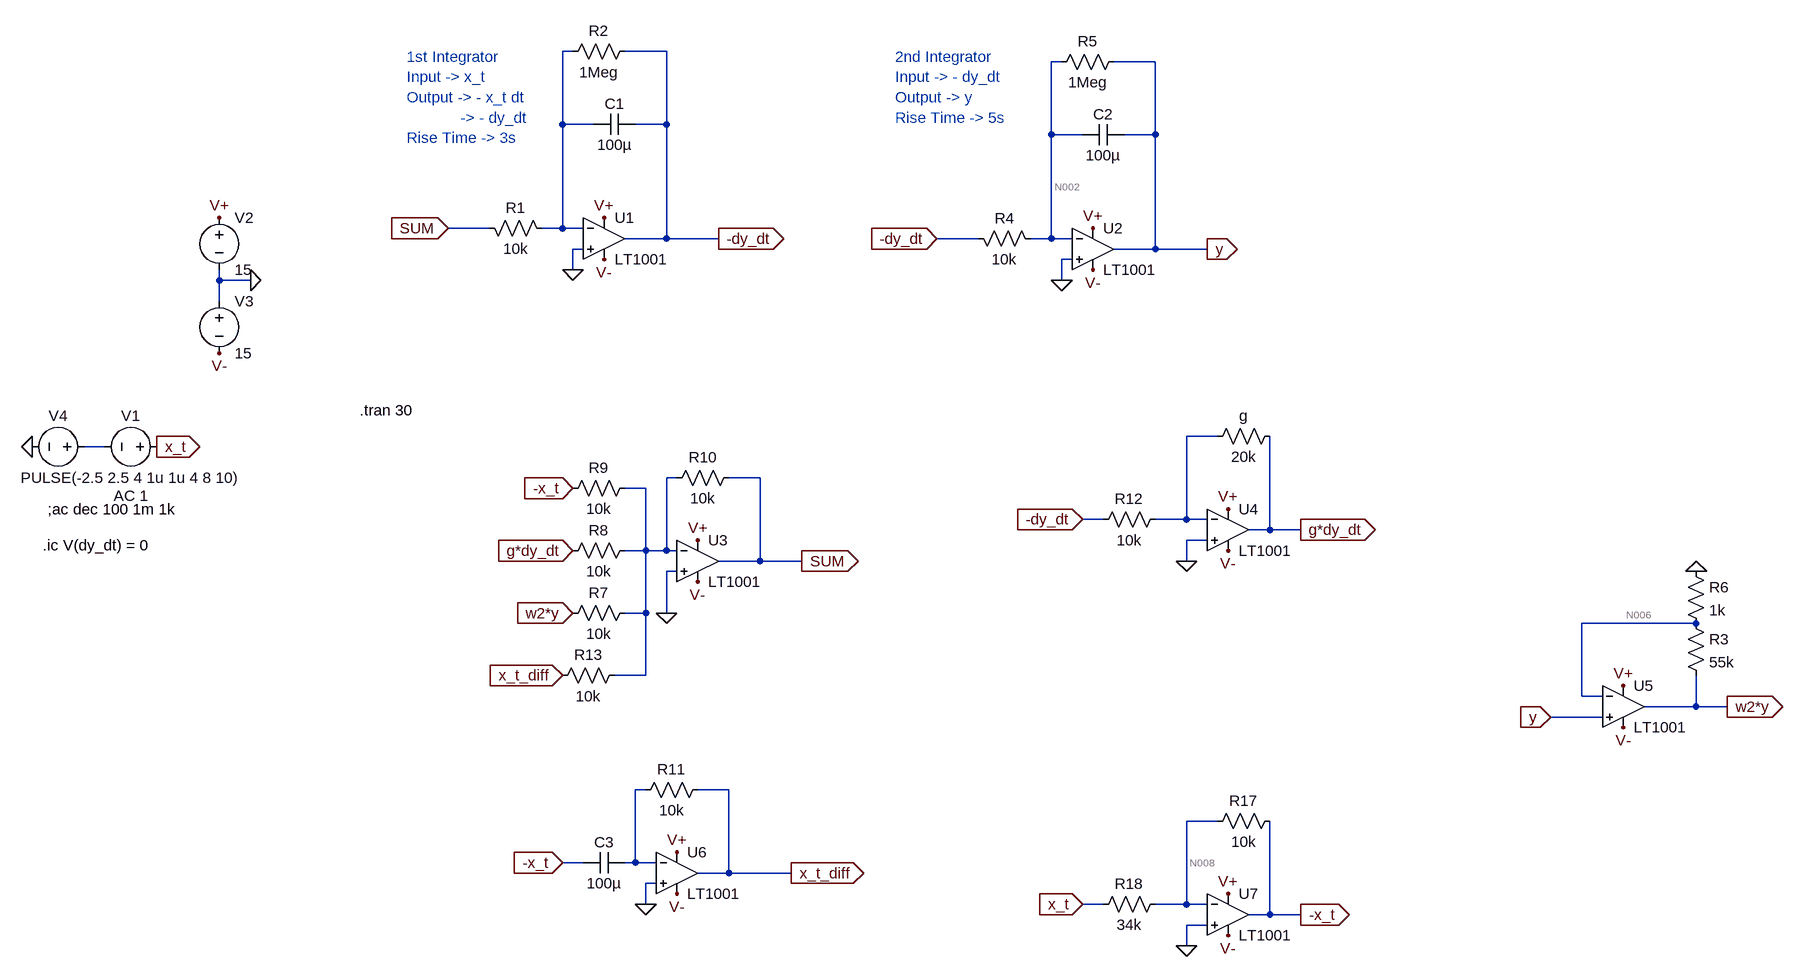
[diagram p0: schematic Analogue_Computer_5.asc]
Analogue_Computer_5.asc, the LTspice schematic file:
Version 4
SHEET 1 1932 1080
WIRE 32 -352 16 -352
WIRE 176 -352 112 -352
WIRE 784 -336 768 -336
WIRE 928 -336 864 -336
WIRE 16 -240 16 -352
WIRE 64 -240 16 -240
WIRE 176 -240 176 -352
WIRE 176 -240 128 -240
WIRE 768 -224 768 -336
WIRE 816 -224 768 -224
WIRE 928 -224 928 -336
WIRE 928 -224 880 -224
WIRE -96 -80 -160 -80
WIRE 16 -80 16 -240
WIRE 16 -80 -16 -80
WIRE 48 -80 16 -80
WIRE 176 -64 176 -240
WIRE 176 -64 112 -64
WIRE 256 -64 176 -64
WIRE 656 -64 592 -64
WIRE 768 -64 768 -224
WIRE 768 -64 736 -64
WIRE 800 -64 768 -64
WIRE 48 -48 32 -48
WIRE 928 -48 928 -224
WIRE 928 -48 864 -48
WIRE 1008 -48 928 -48
WIRE 800 -32 784 -32
WIRE 32 -16 32 -48
WIRE -512 0 -512 -16
WIRE -464 0 -512 0
WIRE 784 0 784 -32
WIRE -512 32 -512 0
WIRE 1024 240 976 240
WIRE -688 256 -720 256
WIRE 192 304 176 304
WIRE 320 304 272 304
WIRE 144 320 112 320
WIRE 848 368 816 368
WIRE 976 368 976 240
WIRE 976 368 928 368
WIRE 1008 368 976 368
WIRE 1104 384 1104 240
WIRE 1104 384 1072 384
WIRE 1152 384 1104 384
WIRE 1008 400 976 400
WIRE 144 416 144 320
WIRE 144 416 112 416
WIRE 176 416 176 304
WIRE 176 416 144 416
WIRE 192 416 176 416
WIRE 320 432 320 304
WIRE 320 432 256 432
WIRE 384 432 320 432
WIRE 976 432 976 400
WIRE 192 448 176 448
WIRE 144 512 144 416
WIRE 144 512 112 512
WIRE 176 512 176 448
WIRE 1760 528 1584 528
WIRE 144 608 144 512
WIRE 144 608 96 608
WIRE 1584 640 1584 528
WIRE 1616 640 1584 640
WIRE 1760 656 1760 608
WIRE 1760 656 1680 656
WIRE 1808 656 1760 656
WIRE 1616 672 1536 672
WIRE 144 784 128 784
WIRE 272 784 224 784
WIRE 1024 832 976 832
WIRE 48 896 16 896
WIRE 128 896 128 784
WIRE 128 896 112 896
WIRE 160 896 128 896
WIRE 272 912 272 784
WIRE 272 912 224 912
WIRE 368 912 272 912
WIRE 160 928 144 928
WIRE 144 960 144 928
WIRE 848 960 816 960
WIRE 976 960 976 832
WIRE 976 960 928 960
WIRE 1008 960 976 960
WIRE 1104 976 1104 832
WIRE 1104 976 1072 976
WIRE 1152 976 1104 976
WIRE 1008 992 976 992
WIRE 976 1024 976 992
FLAG -464 0 0
FLAG -512 -96 V+
FLAG -512 112 V-
FLAG 80 -96 V+
FLAG 80 -32 V-
FLAG 256 -64 -dy_dt
IOPIN 256 -64 Out
FLAG -608 256 x_t
IOPIN -608 256 Out
FLAG 832 -80 V+
FLAG 832 -16 V-
FLAG 1008 -48 y
IOPIN 1008 -48 Out
FLAG 592 -64 -dy_dt
IOPIN 592 -64 In
FLAG 224 400 V+
FLAG 224 464 V-
FLAG 384 432 SUM
IOPIN 384 432 Out
FLAG 176 512 0
FLAG -160 -80 SUM
IOPIN -160 -80 In
FLAG 976 432 0
FLAG 816 368 -dy_dt
IOPIN 816 368 In
FLAG 1152 384 g*dy_dt
IOPIN 1152 384 Out
FLAG 976 1024 0
FLAG 816 960 x_t
IOPIN 816 960 In
FLAG 1152 976 -x_t
IOPIN 1152 976 Out
FLAG 32 320 -x_t
IOPIN 32 320 In
FLAG 32 512 w2*y
IOPIN 32 512 In
FLAG 32 416 g*dy_dt
IOPIN 32 416 In
FLAG 1040 944 V+
FLAG 1040 352 V+
FLAG 1040 1008 V-
FLAG 1040 416 V-
FLAG -800 256 0
FLAG 32 -16 0
FLAG 784 0 0
FLAG 1648 624 V+
FLAG 1648 688 V-
FLAG 1536 672 y
IOPIN 1536 672 In
FLAG 1760 448 0
FLAG 1808 656 w2*y
IOPIN 1808 656 Out
FLAG 192 880 V+
FLAG 192 944 V-
FLAG 144 960 0
FLAG 16 896 -x_t
IOPIN 16 896 In
FLAG 368 912 x_t_diff
IOPIN 368 912 Out
FLAG 16 608 x_t_diff
IOPIN 16 608 In
SYMBOL OpAmps\\LT1001 80 -128 R0
SYMATTR InstName U1
SYMBOL res -112 -96 M90
WINDOW 0 0 56 VBottom 2
WINDOW 3 32 56 VTop 2
SYMATTR InstName R1
SYMATTR Value 10k
SYMBOL voltage -592 256 R90
WINDOW 0 -32 56 VBottom 2
WINDOW 3 32 56 VTop 2
WINDOW 123 60 56 VTop 2
WINDOW 39 0 0 Left 0
SYMATTR InstName V1
SYMATTR Value PULSE(-2.5 2.5 4 1u 1u 4 8 10)
SYMATTR Value2 AC 1
SYMBOL voltage -512 -112 R0
WINDOW 123 0 0 Left 0
WINDOW 39 0 0 Left 0
SYMATTR InstName V2
SYMATTR Value 15
SYMBOL voltage -512 16 R0
WINDOW 123 0 0 Left 0
WINDOW 39 0 0 Left 0
SYMATTR InstName V3
SYMATTR Value 15
SYMBOL cap 128 -256 R90
WINDOW 0 0 32 VBottom 2
WINDOW 3 32 32 VTop 2
SYMATTR InstName C1
SYMATTR Value 100µ
SYMBOL res 128 -368 R90
WINDOW 0 0 56 VBottom 2
WINDOW 3 32 56 VTop 2
SYMATTR InstName R2
SYMATTR Value 1Meg
SYMBOL OpAmps\\LT1001 832 -112 R0
SYMATTR InstName U2
SYMBOL res 640 -80 M90
WINDOW 0 0 56 VBottom 2
WINDOW 3 32 56 VTop 2
SYMATTR InstName R4
SYMATTR Value 10k
SYMBOL cap 880 -240 R90
WINDOW 0 0 32 VBottom 2
WINDOW 3 32 32 VTop 2
SYMATTR InstName C2
SYMATTR Value 100µ
SYMBOL res 880 -352 R90
WINDOW 0 0 56 VBottom 2
WINDOW 3 32 56 VTop 2
SYMATTR InstName R5
SYMATTR Value 1Meg
SYMBOL OpAmps\\LT1001 224 368 R0
SYMATTR InstName U3
SYMBOL res 128 496 R90
WINDOW 0 0 56 VBottom 2
WINDOW 3 32 56 VTop 2
SYMATTR InstName R7
SYMATTR Value 10k
SYMBOL res 128 400 R90
WINDOW 0 0 56 VBottom 2
WINDOW 3 32 56 VTop 2
SYMATTR InstName R8
SYMATTR Value 10k
SYMBOL res 128 304 R90
WINDOW 0 0 56 VBottom 2
WINDOW 3 32 56 VTop 2
SYMATTR InstName R9
SYMATTR Value 10k
SYMBOL res 288 288 R90
WINDOW 0 0 56 VBottom 2
WINDOW 3 32 56 VTop 2
SYMATTR InstName R10
SYMATTR Value 10k
SYMBOL OpAmps\\LT1001 1040 320 R0
SYMATTR InstName U4
SYMBOL res 1120 224 R90
WINDOW 0 0 56 VBottom 2
WINDOW 3 32 56 VTop 2
SYMATTR InstName g
SYMATTR Value 20k
SYMBOL res 944 352 R90
WINDOW 0 0 56 VBottom 2
WINDOW 3 32 56 VTop 2
SYMATTR InstName R12
SYMATTR Value 10k
SYMBOL OpAmps\\LT1001 1040 912 R0
SYMATTR InstName U7
SYMBOL res 1120 816 R90
WINDOW 0 0 56 VBottom 2
WINDOW 3 32 56 VTop 2
SYMATTR InstName R17
SYMATTR Value 10k
SYMBOL res 944 944 R90
WINDOW 0 0 56 VBottom 2
WINDOW 3 32 56 VTop 2
SYMATTR InstName R18
SYMATTR Value 34k
SYMBOL voltage -704 256 R90
WINDOW 0 -32 56 VBottom 2
WINDOW 3 32 56 VTop 2
WINDOW 123 0 0 Left 0
WINDOW 39 0 0 Left 0
SYMATTR InstName V4
SYMATTR Value ""
SYMBOL OpAmps\\LT1001 1648 592 R0
SYMATTR InstName U5
SYMBOL res 1744 512 R0
SYMATTR InstName R3
SYMATTR Value 55k
SYMBOL res 1744 432 R0
SYMATTR InstName R6
SYMATTR Value 1k
SYMBOL OpAmps\\LT1001 192 848 R0
SYMATTR InstName U6
SYMBOL cap 112 880 R90
WINDOW 0 0 32 VBottom 2
WINDOW 3 32 32 VTop 2
SYMATTR InstName C3
SYMATTR Value 100µ
SYMBOL res 240 768 R90
WINDOW 0 0 56 VBottom 2
WINDOW 3 32 56 VTop 2
SYMATTR InstName R11
SYMATTR Value 10k
SYMBOL res 112 592 R90
WINDOW 0 0 56 VBottom 2
WINDOW 3 32 56 VTop 2
SYMATTR InstName R13
SYMATTR Value 10k
TEXT -776 352 Left 2 !;ac dec 100 1m 1k
TEXT -784 408 Left 2 !.ic V(dy_dt) = 0
TEXT -224 -344 Left 2 ;1st Integrator\nInput -> x_t\nOutput -> - x_t dt\n            -> - dy_dt\nRise Time -> 3s
TEXT 528 -344 Left 2 ;2nd Integrator\nInput -> - dy_dt\nOutput -> y\nRise Time -> 5s
TEXT -296 200 Left 2 !.tran 30

The netlist it stands for:
* Analogue_Computer_5.asc
XU1 0 N001 V+ V- -dy_dt LT1001  ; pins In+ In- V+ V- OUT
R1 SUM N001 10k
V1 x_t N004 PULSE(-2.5 2.5 4 1u 1u 4 8 10) AC 1
V2 V+ 0 15
V3 0 V- 15
C1 -dy_dt N001 100µ
R2 -dy_dt N001 1Meg
XU2 0 N002 V+ V- y LT1001  ; pins In+ In- V+ V- OUT
R4 -dy_dt N002 10k
C2 y N002 100µ
R5 y N002 1Meg
XU3 0 N005 V+ V- SUM LT1001  ; pins In+ In- V+ V- OUT
R7 N005 w2*y 10k
R8 N005 g*dy_dt 10k
R9 N005 -x_t 10k
R10 SUM N005 10k
XU4 0 N003 V+ V- g*dy_dt LT1001  ; pins In+ In- V+ V- OUT
R§g g*dy_dt N003 20k
R12 N003 -dy_dt 10k
XU7 0 N008 V+ V- -x_t LT1001  ; pins In+ In- V+ V- OUT
R17 -x_t N008 10k
R18 N008 x_t 34k
V4 N004 0
XU5 y N006 V+ V- w2*y LT1001  ; pins In+ In- V+ V- OUT
R3 N006 w2*y 55k
R6 0 N006 1k
XU6 0 N007 V+ V- x_t_diff LT1001  ; pins In+ In- V+ V- OUT
C3 N007 -x_t 100µ
R11 x_t_diff N007 10k
R13 N005 x_t_diff 10k
;ac dec 100 1m 1k
.ic V(dy_dt) = 0
* 1st Integrator
* Input -> x_t
* Output -> - x_t dt
*             -> - dy_dt
* Rise Time -> 3s
* 2nd Integrator
* Input -> - dy_dt
* Output -> y
* Rise Time -> 5s
.tran 30
.lib LTC.lib
.backanno
.end

* Results of the author's LTspice run, read from the files saved beside the schematic
* Operating Point, zero values left out:
*   V(v+) = 15 V
*   V(v-) = -15 V
*   V(-dy_dt) = 131.3 µV
*   V(sum) = -1.313 µV
*   V(x_t) = -2.5 V
*   V(n002) = 17.59 nV
*   V(y) = -13.13 mV
*   V(w2*y) = -735 mV
*   V(g*dy_dt) = -262.6 µV
*   V(-x_t) = 735.3 mV
*   V(n008) = -991.8 nV
*   V(n006) = -13.13 mV
*   I(R6) = 13.13 µA
*   I(R3) = 13.13 µA
*   I(R18) = 73.53 µA
*   I(R17) = 73.53 µA
*   I(R12) = -13.13 nA
*   I(G) = -13.13 nA
*   I(R10) = -131.3 pA
*   I(R9) = -73.53 µA
*   I(R8) = 26.26 nA
*   I(R7) = 73.5 µA
*   I(R5) = -13.13 nA
*   I(R4) = 13.13 nA
*   I(R2) = 131.3 pA
*   I(R1) = -131.3 pA
*   I(V4) = 73.53 µA
*   I(V3) = -15.72 mA
*   I(V2) = -15.78 mA
*   I(V1) = 73.53 µA